# Altium schematic sheet sensors.SchDoc
size A4
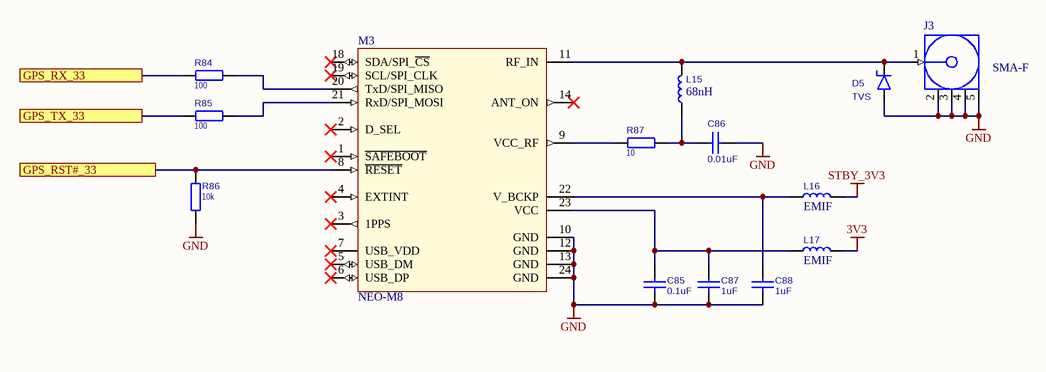
[diagram p0: sensors.SchDoc]

## Parts
C85  value 0.1uF  [C0603]  (hidden comment: C1608X7R1H104K080AA)
C86  value 0.01uF  [C0603]  (hidden comment: CL10B103KB8NNNC)
C87  value 1uF  [C0603]  (hidden comment: GRM188R61H105KAALD)
C88  value 1uF  [C0603]  (hidden comment: GRM188R61H105KAALD)
D5  value TVS  [SOD-323]  (hidden comment: CDSOD323-T05LC)
J3  value SMA-F  [MCX5.08-H5]  (hidden comment: CON SMA-F S-037-TGG R/A PCB)
L15  value 68nH  [IND0603]  (hidden comment: CLH1608T-68NJ-S)
L16  value EMIF  [IND0603]  (hidden comment: BLM18AG102SN1D)
L17  value EMIF  [IND0805]  (hidden comment: BLM21PG221SN1D)
M3  NEO-M8  [NEO-M8N]
R84  100  [R0603]
R85  100  [R0603]
R86  10k  [R0603]
R87  10  [R0603]

## Ports
GPS_RST#_33, GPS_RX_33, GPS_TX_33

## Nets
3V3: L17.1
GND: C85.2 C86.1 C87.1 C88.1 D5.1(A) J3.2(GND) J3.3(GND) J3.4(GND) J3.5(GND) M3.10(GND) M3.12(GND) M3.13(GND) M3.24(GND) R86.2
STBY_3V3: L16.2
GPS_RST#_33: M3.8(~{RESET}) R86.1 ; port GPS_RST#_33
GPS_RX_33: R84.1 ; port GPS_RX_33
GPS_TX_33: R85.1 ; port GPS_TX_33
NetC85_1: C85.1 C87.2 L17.2 M3.23(VCC)
NetC86_2: C86.2 L15.1 R87.2
NetC88_2: C88.2 L16.1 M3.22(V_BCKP)
NetD5_2: D5.2(K) J3.1(Signal) L15.2 M3.11(RF_IN)
NetM3_9: M3.9(VCC_RF) R87.1
NetM3_20: M3.20(TxD/SPI_MISO) R84.2
NetM3_21: M3.21(RxD/SPI_MOSI) R85.2

Not connected (* = marked no-connect by the designer): M3 1(~{SAFEBOOT})* 2(D_SEL)* 3(1PPS)* 4(EXTINT)* 5(USB_DM)* 6(USB_DP)* 7(USB_VDD)* 14(ANT_ON)* 18(SDA/SPI_~{CS})* 19(SCL/SPI_CLK)*

## Library data of the parts
C85-C88 = CAP_NPOL
D5 = ZENNER_1: TVS Diode
J3 = COAX-F: RF Coaxial PCB Connector, MCX; Thru-Hole, Right-Angle Mount Socket, Blunt Post Terminal, 50 Ohm Impedance; PCB_Layout: Complies with manufacturer's recommendation.; DrillSize: Corresponds to nominal value.; Published: 15-Jul-2004; LatestRevisionDate: 15-Jul-2004; LatestRevisionNote: Component Replaced.; DatasheetDocument: 30-May-2003; PackageDocument: 04-Jul-1999; PackageReference: 919-119J-51AX; Publisher: Altium Limited; ComponentLink1Description: Manufacturer Link; ComponentLink1URL: http://www.amphenolrf.com/
L15-L17 = IND_WO_IRON
M3 = NEO-M8: NEO-M8 concurrent GNSS modules; value: NEO-M8
R84-R87 = RESISTOR: RES
  R84 R85: Value: 100
  R86: Value: 10k
  R87: Value: 10